# EAGLE design Complete_ePaper_Shoe_Board (EAGLE 8.4.1)

## Sheet 1 of 3
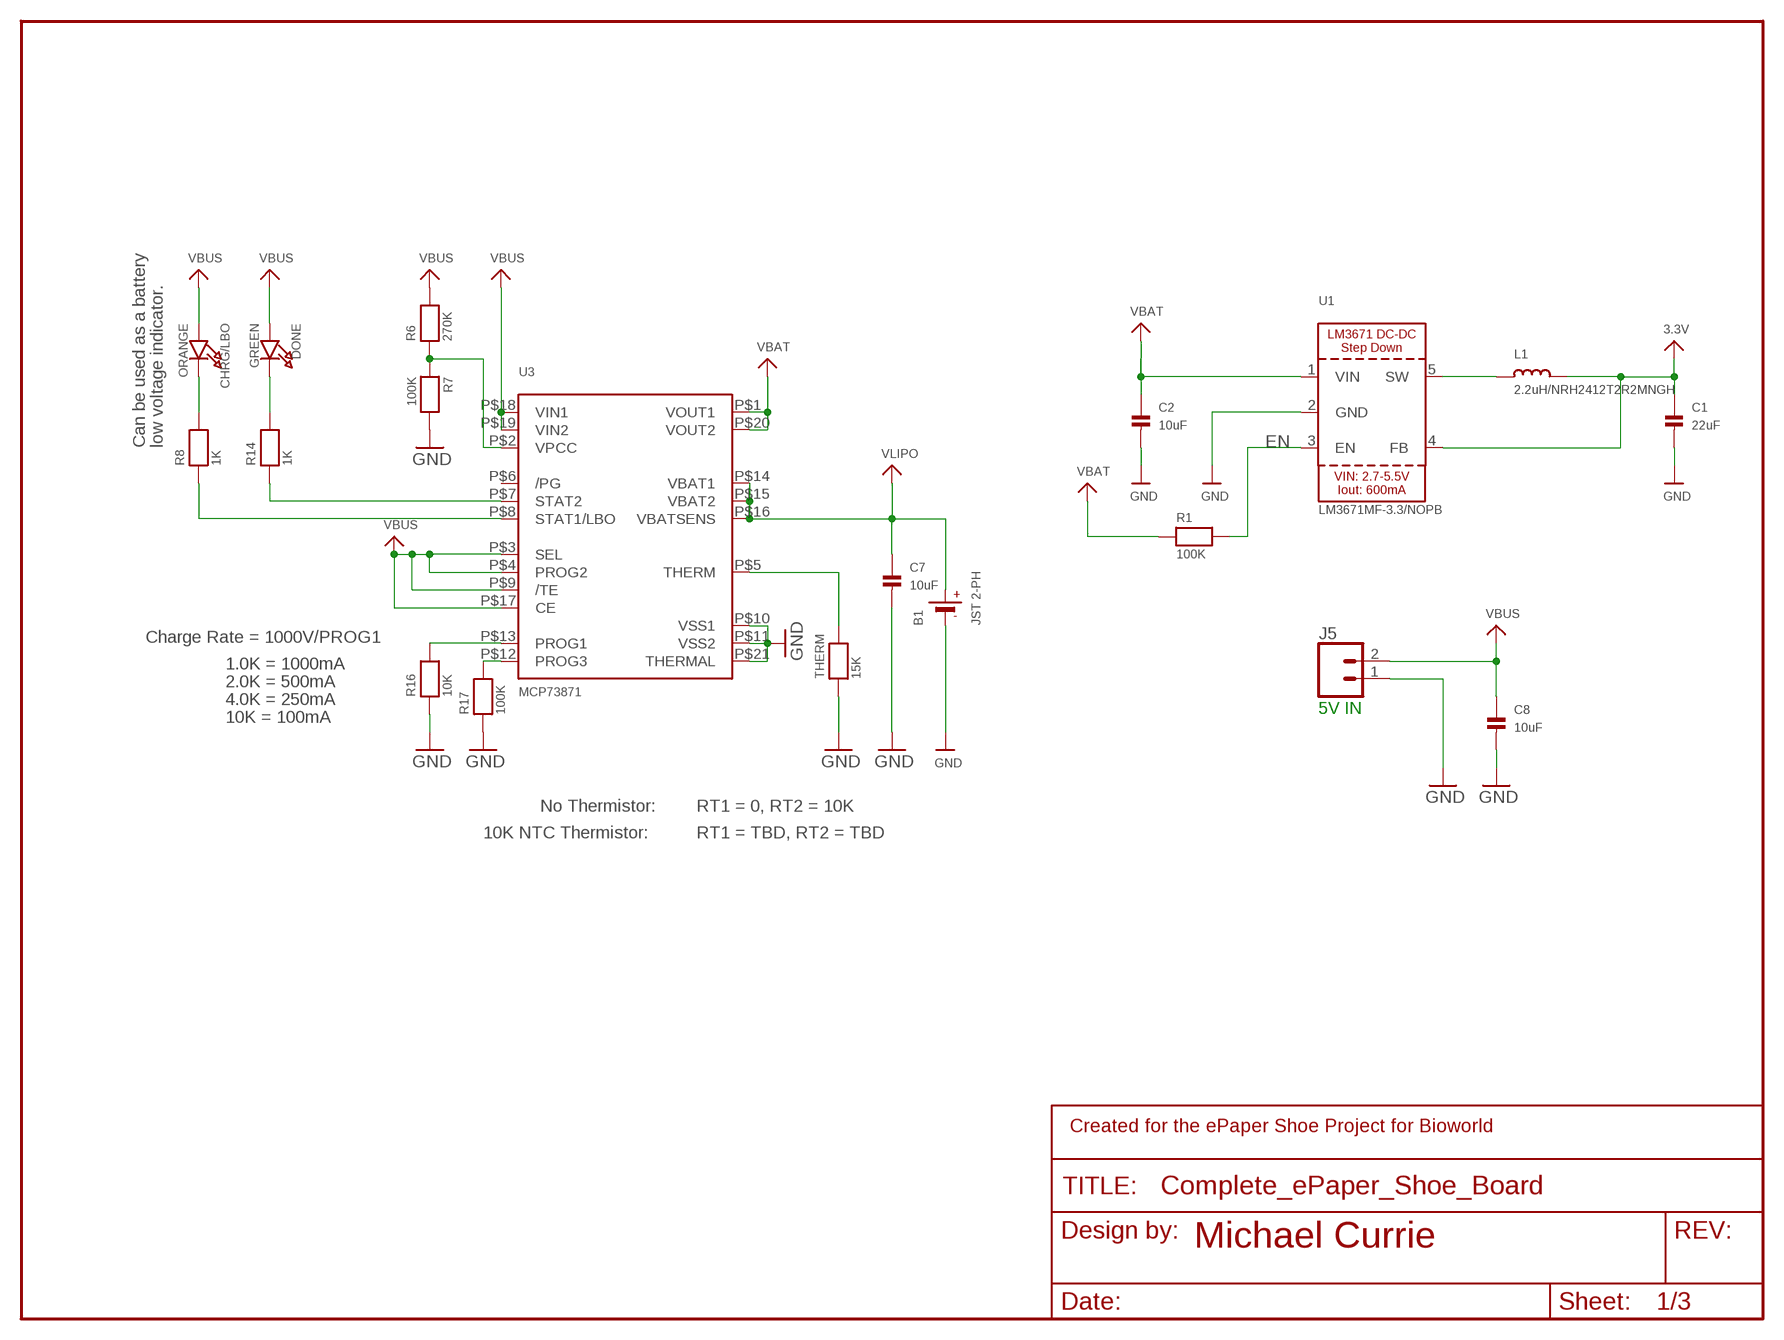
[diagram p0: schematic, sheet 1]

### Parts
B1  JST 2-PH  BATTERY  [JSTPH2]
C1  22uF  CAP_CERAMIC0805  [0805]
C2  10uF  CAP_CERAMIC0805  [0805]
C7  10uF  CAP_CERAMIC0805  [0805]
C8  10uF  CAP_CERAMIC0805  [0805]
CHRG/LBO  ORANGE  LED0805_NOOUTLINE  [CHIPLED_0805_NOOUTLINE]
DONE  GREEN  LED0805_NOOUTLINE  [CHIPLED_0805_NOOUTLINE]
FRAME1  FRAME-LETTER-MICHAELNO_PACKAGE  [DUMMY]
J5  CONN_02  [1X02]
L1  2.2uH/NRH2412T2R2MNGH  INDUCTORNR5040  [INDUCTOR_5X5MM_NR5040_NOTHERMALS]
R1  100K  RESISTOR0805  [0805]
R6  270K  RESISTOR0805  [0805]
R7  100K  RESISTOR0805  [0805]
R8  1K  RESISTOR0805  [0805]
R14  1K  RESISTOR0805  [0805]
R16  10K  RESISTOR0805  [0805]
R17  100K  RESISTOR0805  [0805]
THERM  15K  RESISTOR0805  [0805]
U1  LM3671MF-3.3/NOPB  VREG_LM3671  [SOT23-5]
U3  MCP73871  [QFN20_4MM]

### Nets
3.3V: C1.1 L1.P$2 U1.4(FB) ; also sheet 2,3
EN: R1.2 U1.3(EN)
GND: B1.1(-) C1.2 C2.2 C7.2 C8.2 J5.1 R7.2 R16.1 R17.1 THERM.1 U1.2(GND) U3.P$10(VSS1) U3.P$11(VSS2) U3.P$21(THERMAL) ; also sheet 2,3
N$1: L1.P$1 U1.5(SW)
N$7: R6.1 R7.1 U3.P$2(VPCC)
N$8: DONE.C R14.2
N$9: R14.1 U3.P$7(STAT2)
N$10: THERM.2 U3.P$5(THERM)
N$11: R8.1 U3.P$8(STAT1/LBO)
N$12: CHRG/LBO.C R8.2
N$13: R17.2 U3.P$12(PROG3)
N$16: R16.2 U3.P$13(PROG1)
VBAT: C2.1 R1.1 U1.1(VIN) U3.P$1(VOUT1) U3.P$20(VOUT2)
VBUS: C8.1 CHRG/LBO.A DONE.A J5.2 R6.2 U3.P$3(SEL) U3.P$4(PROG2) U3.P$9(/TE) U3.P$17(CE) U3.P$18(VIN1) U3.P$19(VIN2)
VLIPO: B1.2(+) C7.1 U3.P$14(VBAT1) U3.P$15(VBAT2) U3.P$16(VBATSENS)
Unconnected: U3.P$6(/PG)

### Notes on the sheet
- Can be used as a battery | low voltage indicator.
- Charge Rate = 1000V/PROG1
- 1.0K = 1000mA
- 2.0K = 500mA
- 4.0K = 250mA
- 5V IN
- 10K = 100mA
- No Thermistor: | RT1 = 0, RT2 = 10K
- 10K NTC Thermistor: | RT1 = TBD, RT2 = TBD

## Sheet 2 of 3
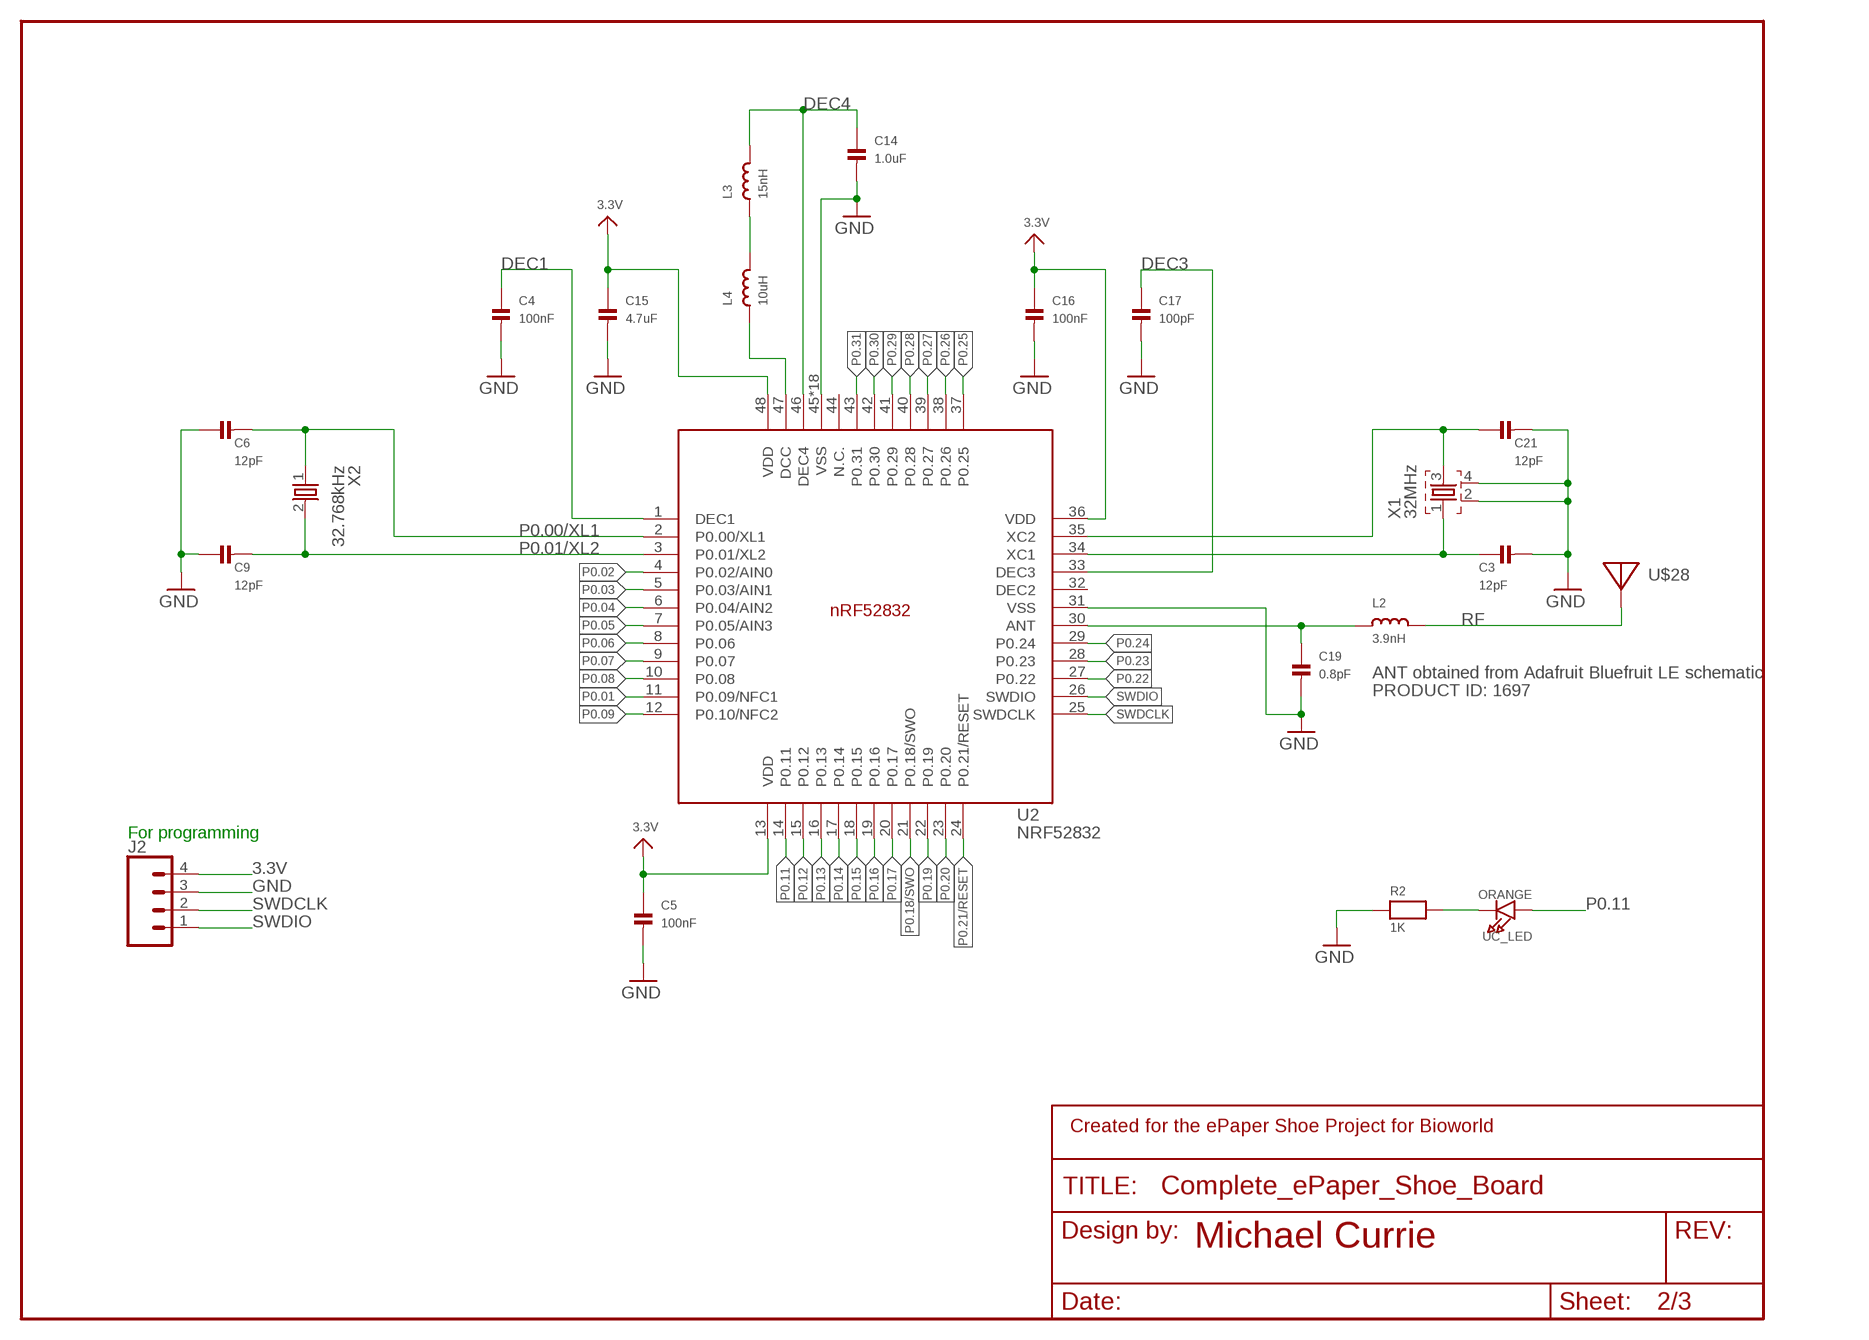
[diagram p1: schematic, sheet 2]

### Parts
C3  12pF  CAP_CERAMIC0805  [0805]
C4  100nF  CAP_CERAMIC0805  [0805]
C5  100nF  CAP_CERAMIC0805  [0805]
C6  12pF  CAP_CERAMIC0805  [0805]
C9  12pF  CAP_CERAMIC0805  [0805]
C14  1.0uF  CAP_CERAMIC0805  [0805]
C15  4.7uF  CAP_CERAMIC0805  [0805]
C16  100nF  CAP_CERAMIC0805  [0805]
C17  100pF  CAP_CERAMIC0805  [0805]
C19  0.8pF  CAP_CERAMIC0805  [0805]
C21  12pF  CAP_CERAMIC0805  [0805]
FRAME2  FRAME-LETTER-MICHAELNO_PACKAGE  [DUMMY]
J2  CONN_04  [1X04]
L2  3.9nH  INDUCTOR0805  [0805]
L3  15nH  INDUCTOR0805  [0805]
L4  10uH  INDUCTOR0805  [0805]
R2  1K  RESISTOR0805  [0805]
U2  NRF52832  [QFN40P600X600X90-48_N]
U$28  ANTENNA_PCBNRF8001_1.6MM  [ANT_PCB_2.4GHZ_NRF8001_1.6MM_1OZ]
UC_LED  ORANGE  LED0805_NOOUTLINE  [CHIPLED_0805_NOOUTLINE]
X1  32MHz  XTAL_32MHZ  [BT-XTAL_2016_N]
X2  32.768kHz  XTAL_32KHZ  [XTAL_3215_N]

### Nets
3.3V: C5.1 C15.1 C16.1 J2.4 U2.13(VDD) U2.36(VDD) U2.48(VDD) ; also sheet 1,3
ANT: C19.1 L2.1 U2.30(ANT)
DEC1: C4.1 U2.1(DEC1)
DEC3: C17.1 U2.33(DEC3)
DEC4: C14.1 L3.2 U2.46(DEC4)
GND: C3.2 C4.2 C5.2 C6.1 C9.1 C14.2 C15.2 C16.2 C17.2 C19.2 C21.2 J2.3 R2.1 U2.31(VSS) U2.45(VSS) U2.PAD(VSS) U2.PAD@VIA01(VSS) U2.PAD@VIA02(VSS) U2.PAD@VIA03(VSS) U2.PAD@VIA04(VSS) U2.PAD@VIA05(VSS) U2.PAD@VIA06(VSS) U2.PAD@VIA07(VSS) U2.PAD@VIA08(VSS) U2.PAD@VIA09(VSS) U2.PAD@VIA10(VSS) U2.PAD@VIA11(VSS) U2.PAD@VIA12(VSS) U2.PAD@VIA13(VSS) U2.PAD@VIA14(VSS) U2.PAD@VIA15(VSS) U2.PAD@VIA16(VSS) X1.2 X1.4 ; also sheet 1,3
N$2: L3.1 L4.2
N$3: C21.1 U2.35(XC2) X1.3
N$5: L4.1 U2.47(DCC)
N$15: R2.2 UC_LED.C
P0.00/XL1: C6.2 U2.2(P0.00/XL1) X2.1
P0.01: U2.11(P0.09/NFC1)
P0.01/XL2: C9.2 U2.3(P0.01/XL2) X2.2
P0.02: U2.4(P0.02/AIN0)
P0.03: U2.5(P0.03/AIN1)
P0.04: U2.6(P0.04/AIN2)
P0.05: U2.7(P0.05/AIN3)
P0.06: U2.8(P0.06)
P0.07: U2.9(P0.07)
P0.08: U2.10(P0.08)
P0.09: U2.12(P0.10/NFC2)
P0.11: U2.14(P0.11) UC_LED.A
P0.12: U2.15(P0.12)
P0.13: U2.16(P0.13)
P0.14: U2.17(P0.14)
P0.15: U2.18(P0.15)
P0.16: U2.19(P0.16)
P0.17: U2.20(P0.17)
P0.18/SWO: U2.21(P0.18/SWO)
P0.19: U2.22(P0.19)
P0.20: U2.23(P0.20)
P0.21/RESET: U2.24(P0.21/RESET)
P0.22: U2.27(P0.22) ; also sheet 3
P0.23: U2.28(P0.23) ; also sheet 3
P0.24: U2.29(P0.24) ; also sheet 3
P0.25: U2.37(P0.25) ; also sheet 3
P0.26: U2.38(P0.26)
P0.27: U2.39(P0.27)
P0.28: U2.40(P0.28)
P0.29: U2.41(P0.29)
P0.30: U2.42(P0.30) ; also sheet 3
P0.31: U2.43(P0.31) ; also sheet 3
RF: L2.2 U$28.FEED
SWDCLK: J2.2 U2.25(SWDCLK)
SWDIO: J2.1 U2.26(SWDIO)
X1: C3.1 U2.34(XC1) X1.1
Unconnected: U2.32(DEC2) U2.44(N.C.)

### Notes on the sheet
- ANT obtained from Adafruit Bluefruit LE schematic
- PRODUCT ID: 1697
- For programming

## Sheet 3 of 3
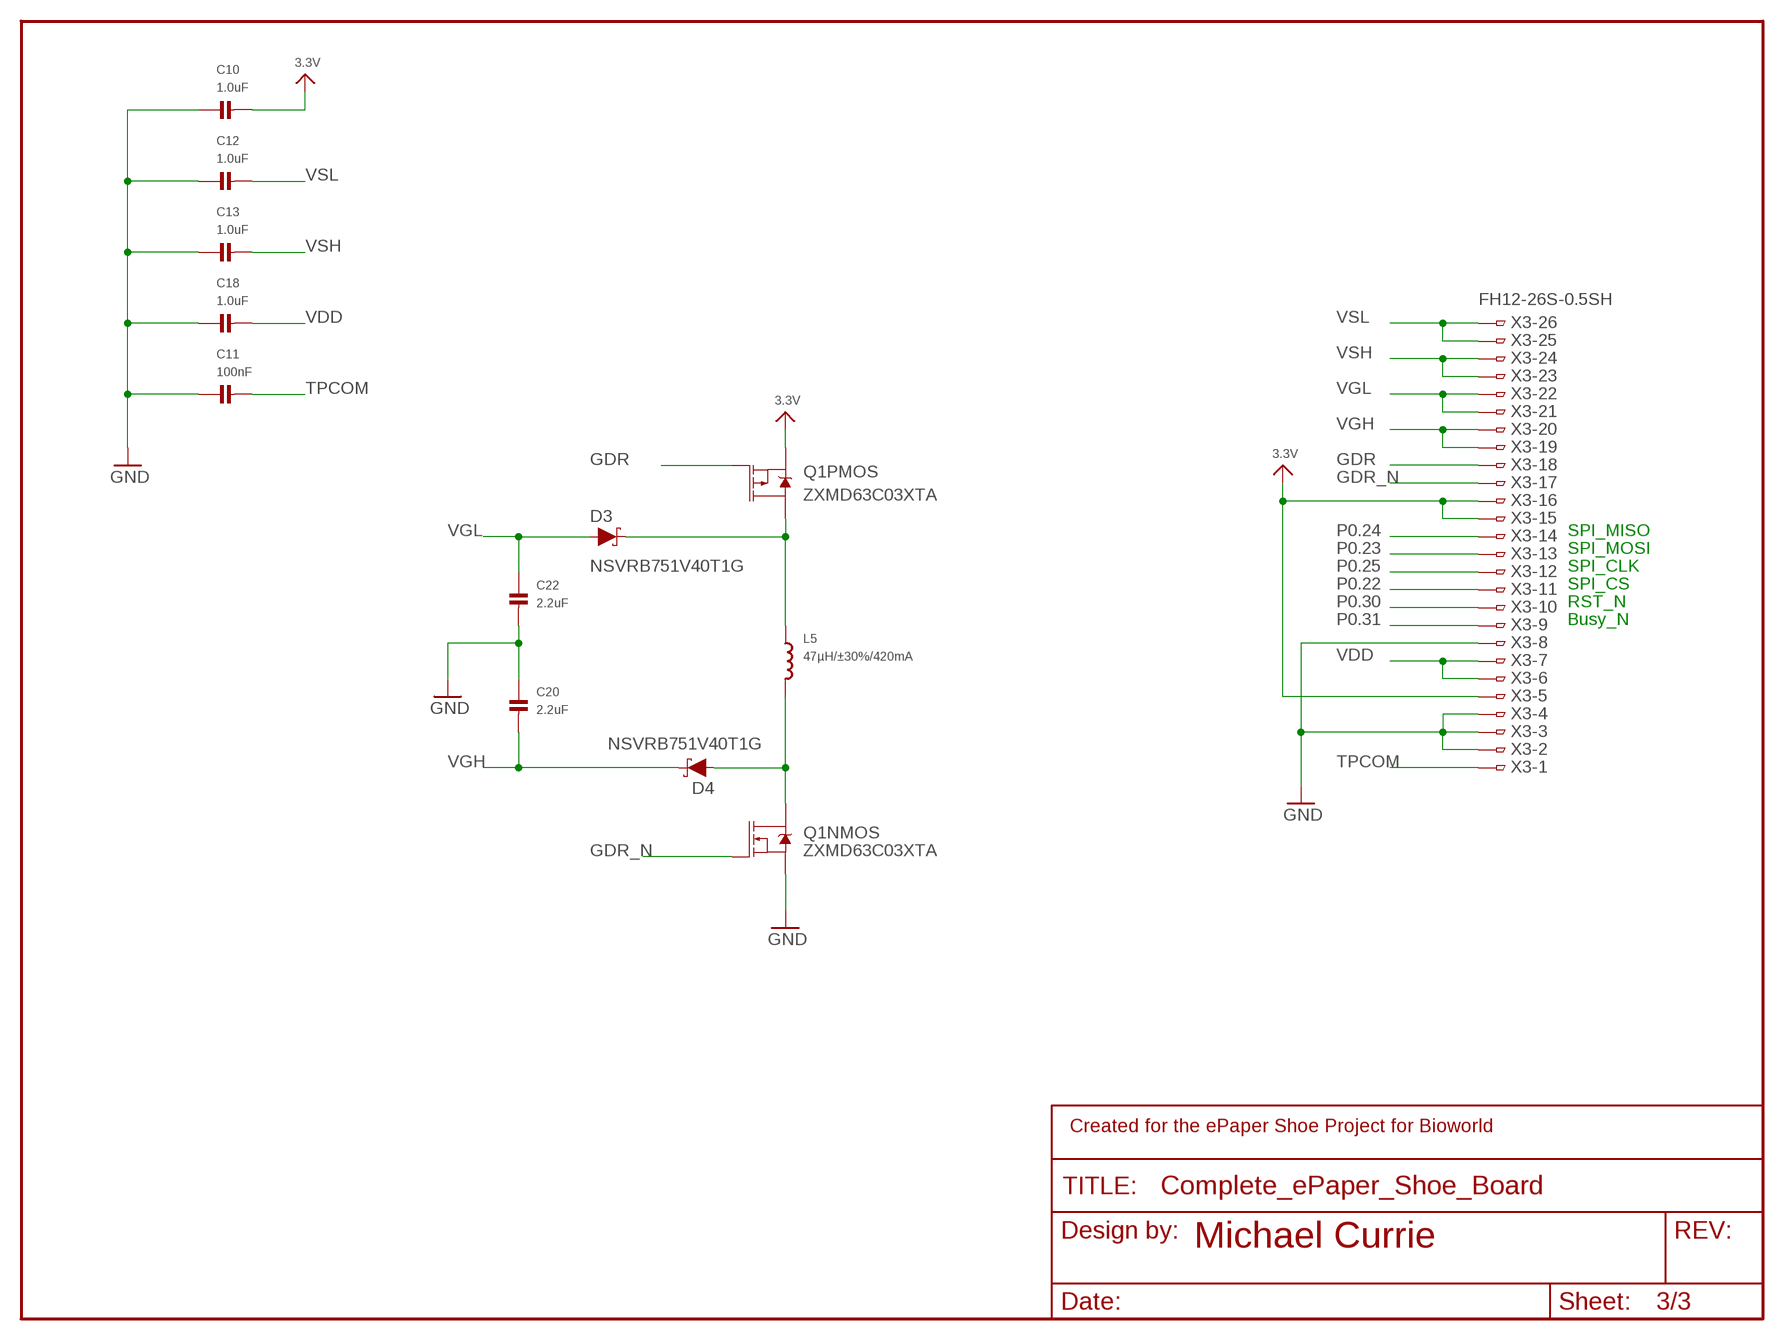
[diagram p2: schematic, sheet 3]

### Parts
C10  1.0uF  CAP_CERAMIC0805  [0805]
C11  100nF  CAP_CERAMIC0805  [0805]
C12  1.0uF  CAP_CERAMIC0805  [0805]
C13  1.0uF  CAP_CERAMIC0805  [0805]
C18  1.0uF  CAP_CERAMIC0805  [0805]
C20  2.2uF  CAP_CERAMIC0805  [0805]
C22  2.2uF  CAP_CERAMIC0805  [0805]
D3  0.5A/40V/420mV  DIODE-SCHOTTKY-PMEG4005EJ  [SOD-323]
D4  0.5A/40V/420mV  DIODE-SCHOTTKY-PMEG4005EJ  [SOD-323]
FRAME3  FRAME-LETTER-MICHAELNO_PACKAGE  [DUMMY]
L5  47µH/±30%/420mA  INDUCTORNR5040  [INDUCTOR_5X5MM_NR5040_NOTHERMALS]
Q1  IRF7509  [MSOP8]
X3  FH12-26S-0.5SH  [FH12-26S-0.5SH]

### Nets
3.3V: C10.2 Q1.3(PMOS:S) X3.5 X3.15 X3.16 ; also sheet 1,2
GDR: Q1.4(PMOS:G) X3.18
GDR_N: Q1.2(NMOS:G) X3.17
GND: C10.1 C11.1 C12.1 C13.1 C18.1 C20.1 C22.2 Q1.1(NMOS:S) X3.2 X3.3 X3.4 X3.8 ; also sheet 1,2
N$4: D3.C L5.P$1 Q1.5(PMOS:D) Q1.6(PMOS:D)
N$6: D4.A L5.P$2 Q1.7(NMOS:D) Q1.8(NMOS:D)
P0.22: X3.11 ; also sheet 2
P0.23: X3.13 ; also sheet 2
P0.24: X3.14 ; also sheet 2
P0.25: X3.12 ; also sheet 2
P0.30: X3.10 ; also sheet 2
P0.31: X3.9 ; also sheet 2
TPCOM: C11.2 X3.1
VDD: C18.2 X3.6 X3.7
VGH: C20.2 D4.C X3.19 X3.20
VGL: C22.1 D3.A X3.21 X3.22
VSH: C13.2 X3.23 X3.24
VSL: C12.2 X3.25 X3.26

### Notes on the sheet
- ZXMD63C03XTA
- SPI_MISO
- SPI_MOSI
- NSVRB751V40T1G | SPI_CLK
- SPI_CS
- RST_N
- Busy_N
- NSVRB751V40T1G
- ZXMD63C03XTA

## Library data of the parts
B1 = microbuilder:BATTERY: CR1220 SMT - Digikey: 3001K-ND
C1-C22 = microbuilder:CAP_CERAMIC: Ceramic Capacitors 0402 - 0402 Surface Mount Capacitors 16pF 50V 5% [Digikey: 445-4899-2-ND] 18pF 50V 5% [Digikey: 490-1281-2-ND] 22pF 50V 5% [Digikey: 490-1283-2-ND] 68pF 50V 5% [Digikey: 490-1289-2-ND] 0.1uF 10V 10% [Digikey: 490-1318-2-ND] 1.0uF 6.3V 10% [Digikey: 490-1320-2-ND] 0603 - 0603 Surface Mount Capacitors 16 pF 50V 5% [Digikey: 445-5051-2-ND] 22 pF 50V [Digikey: PCC220ACVTR-ND] 33 pF 50V 5% [Digikey: 490-1415-1-ND] 56pF 50V 5% [Digikey: 490-1421-1-ND] 220pF 50V 5% [Digikey: 445-1285-1-ND] 680 pF 50V 2200 pF 50V 5% C0G [Digikey: 445-1297-1-ND] 5600 pF 100V 5% X7R [Digikey: 478-3711-1-ND] 0.1 µF 25V 10% [Digikey: PCC2277TR-ND] 0.22 µF 16V 10% X7R [Digikey: 445-1318-1-ND] 1.0 µF 25V 10% [Digikey: 445-5146-2-ND] 0603 - RF Specific 3pF 250V +/-0.1pF RF [Digikey: 712-1347-1-ND] 18 pF 250V 5% [Digikey: 478-3505-1-ND or 712-1322-1-ND] 56 pF 250V 5% C0G RF [Digikey: 490-4867-1-ND] 68 pF 250V RF [Digikey: 490-4868-1-ND] 0805 - 0805 Surface Mount Capacitors 220 pF 250V 2% RF Ceramic Capacitor [Digikey: 712-1398-1-ND] 1000 pF 50V 2% NP0 Ceramic Capacitor [Digikey: 478-3760-1-ND] 0.1 µF 25V 10% Ceramic Capacitor [Digikey: PCC1828TR-ND] 1.0 µF 16V 10% Ceramic Capacitor[Digikey: 490-1691-2-ND] 10.0 µF 10V 10% Ceramic Capacitor[Digikey: 709-1228-1-ND] 10.0 uF 16V 10% Ceramic Capacitor [Digikey: 478-5165-2-ND] 47 uF 6.3V 20% Ceramic Capacitor [Digikey: 587-1779-1-ND or 399-5506-1-ND] 1206 - 1206 Surface Mount Capacitors 47uF 10V 20% Ceramic Capacitor [Digikey: 490-5528-1-ND or 399-5508-1-ND or 445-6010-1-ND] 100uF 6.3V -20%, +80% Y5V Ceramic Capacitor (Digikey: 490-4512-1-ND, Mouser: 81-GRM31CF50J107ZE1L)
CHRG/LBO DONE UC_LED = microbuilder:LED: LED 0603 - 0603 Surface Mount Package 2mA: Green LED - Low Power (3.9mcd, 2ma, 1.7Vf) - Digikey: 475-2709-2-ND Orange LED - Low Power (9.8mcd, 2ma, 1.8Vf) - Digikey: 475-1194-2-ND Red LED - Low Power (5mcd, 2ma, 1.8Vf) - Digikey: 475-1195-2-ND Yellow LED - Low Power (7mcd, 2ma, 1.8Vf) - Digikey: 475-1196-2-ND 5mA: Blue LED - Low Power (17mcd, 5ma, 2.9Vf) - Digikey: LNJ937W8CRACT-ND 0805 - 0805 Surface Mount Package 2mA: Red LED (8.8mcd, 2mA, 1.8Vf, Clear) - Low Power [Digikey: 475-2510-1-ND] Green LED (5mcd, 2mA, 1.8Vf, Clear) - Low Power [Digikey: 475-2730-1-ND] Yellow LED (11.3mcd, 2mA, 1.8Vf, Clear) - Low Power [Digikey: 475-2555-1-ND] 20mA: Red LED (104mcd, 20mA, Diffused) - LS R976 [Digikey: 475-1278-6-ND] Red LED (12mcd, 20mA, 2.0Vf, Clear) - APT2012EC [Digikey: 754-1128-1-ND] Green LED (15mcd, 20mA, 2.2Vf, Clear) - APT2012GC [Digikey: 754-1131-1-ND] Orange LED (160mcd, 20mA, 2.1Vf, Clear) - APT2012SECK [Digikey: 754-1130-1-ND] 1206 - 1206 Surface Mount Package Green LED (26mcd, 20mA, Diffused) - LG N971 [Digikey: 475-1407-6-ND] Red LED (15mcd, 20mA, Diffused) - LH N974 [Digikey: 475-1416-6-ND]
D3 D4 = SparkFun-DiscreteSemi:DIODE-SCHOTTKY: Schottky diode A Schottky diode is a semiconductor diode which has a low forward voltage drop and a very fast switching action.; PROD_ID: DIO-10955
FRAME1-FRAME3 = SparkFun-Aesthetics:FRAME-LETTER-MICHAEL: Schematic Frame - Letter Standard 8.5x11 US Letter frame; DESIGNER: Nobody; VERSION: v01
J2 = SparkFun-Connectors:CONN_04: Multi connection point. Often used as Generic Header-pin footprint for 0.1 inch spaced/style header connections On any of the 0.1 inch spaced packages, you can populate with these: Break Away Headers - Straight <https://www.sparkfun.com/products/116> (PRT-00116) Break Away Male Headers - Right Angle <https://www.sparkfun.com/products/553> (PRT-00553) Female Headers <https://www.sparkfun.com/products/115> (PRT-00115) Break Away Headers - Machine Pin <https://www.sparkfun.com/products/117> (PRT-00117) Break Away Female Headers - Swiss Machine Pin <https://www.sparkfun.com/products/743> (PRT-00743) For SCREWTERMINALS and SPRING TERMINALS visit here: Screw Terimnals on SparkFun.com <https://www.sparkfun.com/search/results?term=Screw+Terminals> (5mm/3.5mm/2.54mm spacing) This device is also useful as a general connection point to wire up your design to another part of your project. Our various solder wires solder well into these plated through hole pads. Hook-Up Wire - Assortment (Stranded, 22 AWG) <https://www.sparkfun.com/products/11375> (PRT-11375) Hook-Up Wire - Assortment (Solid Core, 22 AWG) <https://www.sparkfun.com/products/11367> (PRT-11367) View the entire wire category on our website here <https://www.sparkfun.com/categories/141> Special notes: Molex polarized connector foot print use with SKU : PRT-08231 with associated crimp pins and housings. 1MM SMD Version SKU: PRT-10208; PROD_ID: CONN-09696
J5 = SparkFun-Connectors:CONN_02: Multi connection point. Often used as Generic Header-pin footprint for 0.1 inch spaced/style header connections On any of the 0.1 inch spaced packages, you can populate with these: Break Away Headers - Straight <https://www.sparkfun.com/products/116> (PRT-00116) Break Away Male Headers - Right Angle <https://www.sparkfun.com/products/553> (PRT-00553) Female Headers <https://www.sparkfun.com/products/115> (PRT-00115) Break Away Headers - Machine Pin <https://www.sparkfun.com/products/117> (PRT-00117) Break Away Female Headers - Swiss Machine Pin <https://www.sparkfun.com/products/743> (PRT-00743) For SCREWTERMINALS and SPRING TERMINALS visit here: Screw Terimnals on SparkFun.com <https://www.sparkfun.com/search/results?term=Screw+Terminals> (5mm/3.5mm/2.54mm spacing) This device is also useful as a general connection point to wire up your design to another part of your project. Our various solder wires solder well into these plated through hole pads. Hook-Up Wire - Assortment (Stranded, 22 AWG) <https://www.sparkfun.com/products/11375> (PRT-11375) Hook-Up Wire - Assortment (Solid Core, 22 AWG) <https://www.sparkfun.com/products/11367> (PRT-11367) View the entire wire category on our website here <https://www.sparkfun.com/categories/141> Special notes: Molex polarized connector foot print use with: PRT-08233 with associated crimp pins and housings. 2.54_SCREWTERM for use with PRT-10571. 3.5mm Screw Terminal footprints for PRT-08084 5mm Screw Terminal footprints for use with PRT-08432
L1-L5 = microbuilder:INDUCTOR: Inductors 0603: 10nH Ceramic Inductor - microwire antenna/RF (Digikey: 712-1434-2-ND) 0805: 560nH Ceramic Inductor - RF (Digikey: 553-1047-1-ND) 270nH Ceramic Inductor - Q = 40@250MHz, +-5%, 1 Ohm DC Resistance (Digikey: 535-10506-2-ND) 1007 (2518 Metric) SMT: 10µH 10% 250mOhm 820mA 1007 Inductor (Digikey: 587-2189-1-ND) 22µH 10% 500mOhm 580mA 1007 Inductor (Digikey: 587-2190-1-ND) 47µH 10% 950mOhm 420mA 1007 Inductor (Digikey: 587-2191-1-ND) 47µH 5% 100mOhm 1A 1008 Inductor (Digikey: 732-1816-1-ND) 5.0x5.0mm (Taiyo Yuden NR5040 Series) 6.8µH 20% 2.3A 64mOhm Inductor (Digikey: 587-2374-2-ND) 5.0x5.0mm (TDK VLC5045 Series) 4.7µH 20% 3.3A 34mOhm Inductor (Digikey: 445-6526-1-ND) 6.8µH 20% 2.7A 46mOhm Inductor (Digikey: 445-6527-1-ND) 6.0x6.0mm (TDK VLC6045 Series) 4.7µH 20% 3.8A 27mOhm Inductor (Digikey: 445-6538-2-ND) 6.8µH 20% 3A 41mOhm Inductor (Digikey: 445-6540-1-ND) 6.2µH 30% 2.2A 45mOhm Inductor (Digikey: SRR5028-6R2YCT-ND) - Not TDK VLC6045 but footprint should match 6.0x6.0mm (TDK SLF6045 Series) 6.8uH 30% 2A 33mOhm Inductor (Digikey: 445-4572-1-ND, Mouser: 810-SLF645T6R8N2R0PF)
Q1 = SparkFun-DiscreteSemi:IRF7509: Dual N and P Channel MOSFET Dual N/P-Channel 30V 1.25 W 7.8/7.5 nC Hexfet Power Mosfet Surface Mount-MICRO-8. NMOS RDS(ON) 0.11Ω. PMOS RDS(ON) 0.20Ω. Link to datasheet <http://www.irf.com/product-info/datasheets/data/irf7509pbf.pdf> SparkFun Products: SparkFun RedBot Mainboard <https://www.sparkfun.com/products/12097> SparkFun Wake on Shake <https://www.sparkfun.com/products/11447>; PROD_ID: TRANS-07913
R1 R2 R6-R8 R14 R16 R17 THERM = microbuilder:RESISTOR: Resistors 0402 - 0402 Surface Mount Package 22 Ohm 1% 1/16W [Digikey: 311-22.0LRTR-ND] 33 Ohm 5% 1/16W 1.0K 5% 1/16W 1.5K 5% 1/16W 2.0K 1% 1/16W 10.0K 1% 1/16W [Digikey: 311-10.0KLRTR-ND] 10.0K 5% 1/16W [Digikey: RMCF0402JT10K0TR-ND] 12.1K 1% 1/16W [Digikey: 311-22.0LRTR-ND] 100.0K 5% 1/16W 0603 - 0603 Surface Mount Package 0 Ohm 1/10 Watt 1% Resistor 15 Ohm 1/10 Watt 1% Resistor 33 Ohm 1/10 Watt 1% Resistor 49.9 Ohm 1/10 Watt 1% Resistor 100 Ohm 1/10 Watt 1% Resistor 150 Ohm 1/10 Watt 1% Resistor 240 Ohm 1/10 Watt 1% Resistor 390 Ohm 1/10 Watt 1% Resistor 560 Ohm 1/10 Watt 1% Resistor 680 Ohm 1/10 Watt 1% Resistor 750 Ohm 1/10 Watt 1% Resistor 1.0K Ohm 1/10 Watt 1% Resistor 1.5K Ohm 1/10 Watt 1% Resistor 2.0K Ohm 1/10 Watt 1% Resistor 2.2K Ohm 1/10 Watt 1% Resistor 3.3K Ohm 1/10 Watt 1% Resistor 4.7K Ohm 1/10 Watt 1% Resistor 10.0K Ohm 1/10 Watt 1% Resistor 12.0K Ohm 1/10 Watt 1% Resistor 12.1K Ohm 1/10 Watt 1% Resistor 20.0K Ohm 1/10 Watt 1% Resistor 33.0K Ohm 1/10 Watt 1% Resistor 100.0K Ohm 1/10 Watt 1% Resistor 0805 - 0805 Surface Mount Package 0 Ohm 1/8 Watt 1% Resistor 33 Ohm 1/8 Watt 1% Resistor 100 Ohm 1/8 Watt 1% Resistor 150 Ohm 1/8 Watt 1% Resistor 200 Ohm 1/8 Watt 1% Resistor 240 Ohm 1/8 Watt 1% Resistor 330 Ohm 1/8 Watt 1% Resistor 390 Ohm 1/8 Watt 1% Resistor 470 Ohm 1/8 Watt 1% Resistor 1.0K Ohm 1/8 Watt 1% Resistor 1.5K Ohm 1/8 Watt 1% Resistor 2.0K Ohm 1/8 Watt 1% Resistor 4.7K Ohm 1/8 Watt 1% Resistor 5.1K Ohm 1/8 Watt 1% Resistor 5.6K Ohm 1/8 Watt 1% Resistor 10.0K Ohm 1/8 Watt 1% Resistor 22.0K Ohm 1/8 Watt 1% Resistor 33.0K Ohm 1/8 Watt 1% Resistor 100K Ohm 1/8 Watt 1% Resistor 1206 - 1206 Surface Mount Package 2012 - 2010 Surface Mount Package 0.11 Ohm 1/2 Watt 1% Resistor - Digikey: RHM.11UCT-ND
U1 = microbuilder:VREG_LM3671: LM3671 - 600mA DC-DC Step-Down Converter VIN: 2.7-5.5V Load Current: 600mA Switching Frequency: 2MHz Iq: 16uA
U2 = Nordic_nRF:NRF52832: nRF52832 Features Single chip, highly flexible, 2.4 GHz multi-protocol SoC 32-bit ARM Cortex-M4F Processor 1.7v to 3.6v operation 512kB flash + 64kB RAM Supports concurrent Bluetooth Smart/ANT protocol operation On-chip NFC tag for Out-of-Band (OOB) pairing Up to +4dBm output power -96dBm sensitivity, Bluetooth Smart Thread safe and run-time protected Event driven API On air compatible with nRF24L and nRF24AP series 2 data rates (2Mbps/1Mbps) PPI - maximum flexibility for power-efficient applications and code simplification Automated power management system with automatic power management of each peripheral Configurable I/O mapping for analog and digital I/O 3 x Master/Slave SPI 2 x Two-wire interface (I²C) UART (RTS/CTS) 3 x PWM AES HW encryption Real Time Counter (RTC) Digital microphone interface (PDM) On-chip balun Applications Internet of Things (IoT) Wearables SmartHome sensors Connected white goods Computer peripherals Voice-command smart remotes A4WP ‘Rezence’ wireless charging Beacons Sports and fitness sensors and hubs Connected health products Smart watches RC Toys Interactive games Building automation and sensor networks
U3 = microbuilder:MCP73871: MCP73871 Lithium Polymer Battery Charger Digikey: MCP73871-2CCI/ML-ND
U$28 = microbuilder:ANTENNA_PCB: Various pre-calculated PCB Antennas NRF8001 1.6mm 1Oz - 2.4GHz PCB antenna for 1.6mm PCBs with 1oz copper, double-sided boards (no GND plan beneath antenna). See nRF2740 production files for further information and impedance matching network. 868MHz/2.4GHz DUALBAND - Dual 868MHz and 2.4GHz centered antenna based on board #6 of the CC-ANTENNA-DK from Chipcon/TI
X1 = Nordic_nRF:XTAL_32MHZ
X2 = Nordic_nRF:XTAL_32KHZ
X3 = con-hirose:FH12-26S-0.5S: 0.5mm Pitch Connectors For FPC/FFC Source: Data sheet <http://www.hirose.co.jp/cataloge_hp/e58605370.pdf>; MPN: FH12-26S-0.5SH(55); OC_FARNELL: 1324553; OC_NEWARK: 34M6172

## Board
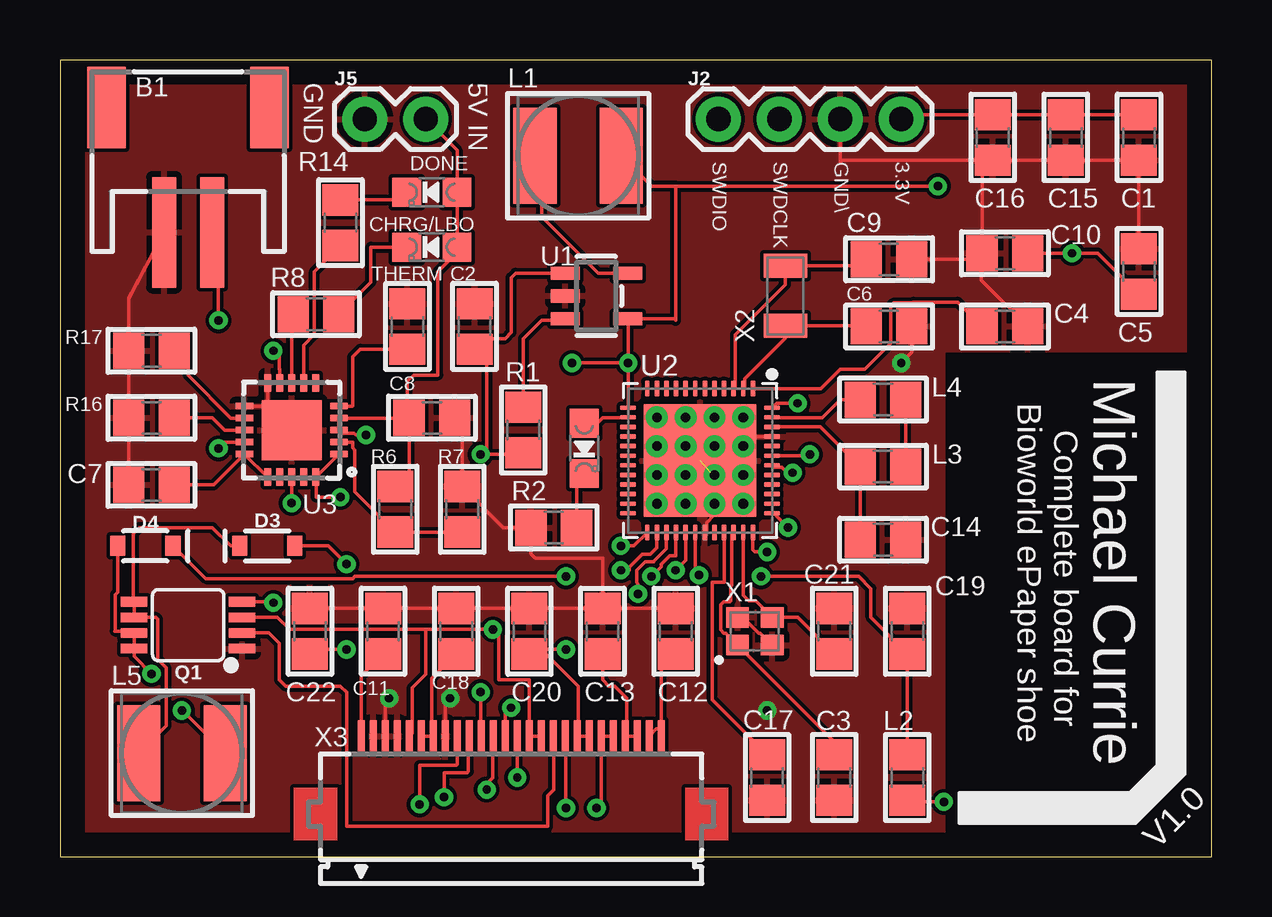
[diagram p3: board, top side]
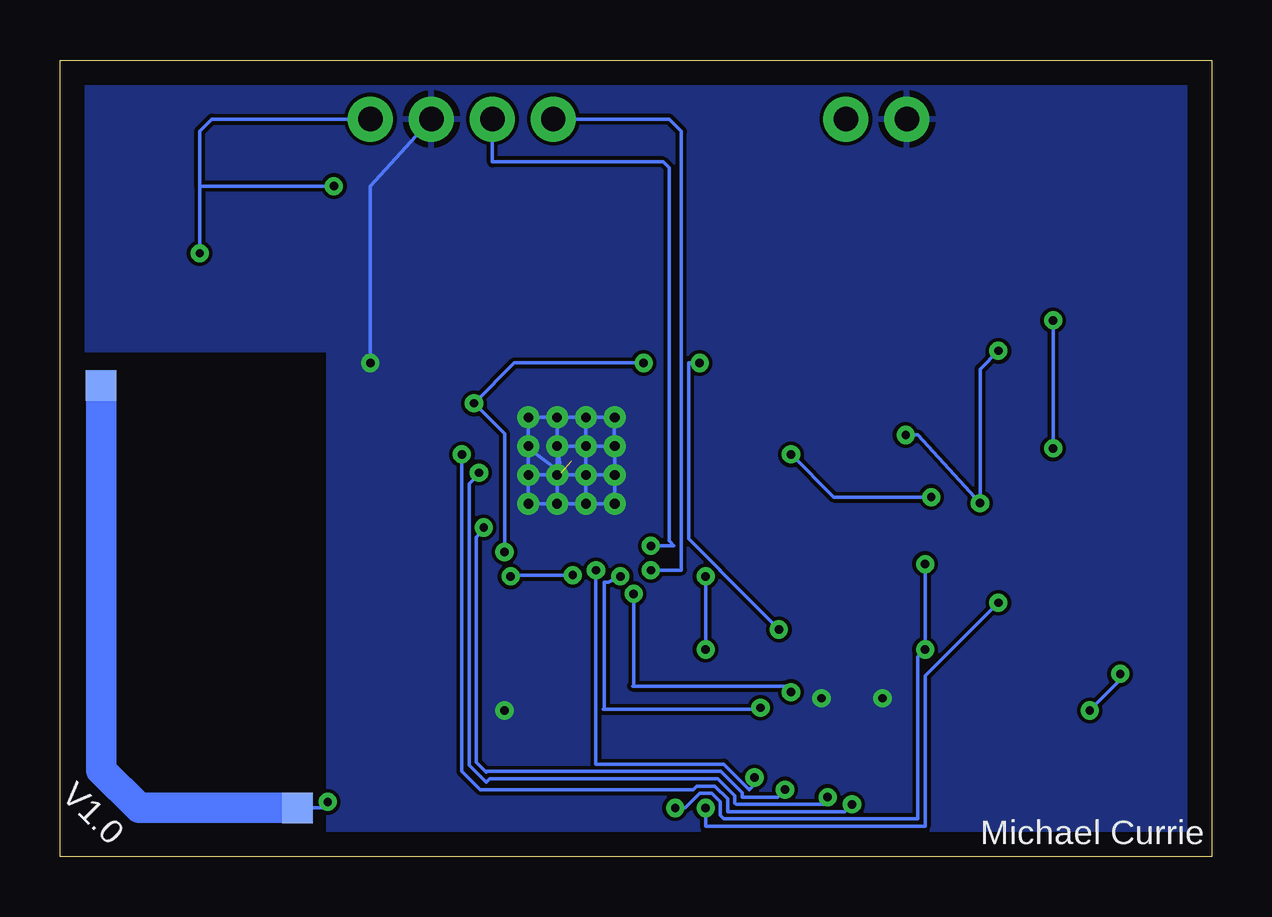
[diagram p4: board, bottom side, seen from below]

Size 47.99 x 33.2 mm. Coordinates in mm from the lower left corner, seen from the top.
Outline: 0,0 47.99,0 47.99,33.2 0,33.2 0,0
Copper layers (1*16): Top 0.035mm / dielectric 1.5mm / Bottom 0.035mm
Design rules "default": minimum track width 6mil, minimum drill 0.35mm, track to track 6mil, track to pad 6mil, pad to pad 6mil, via to via 6mil, smd to smd 6mil, copper to edge 40mil, drill to drill 6mil, minimum pad ring 10mil, minimum via ring 8mil, stop-mask expansion 4mil, vias tented up to drill 0mil, thermal gap 10mil

### Footprints (pad centres in the part's own frame; a part is rotated, then mirrored left to right if it is on the bottom)
JSTPH2 = smd 1 x 4.6: 1 -1,-3.7; 2 1,-3.7 | smd 1.6 x 3.4: NC1 -3.4,1.5; NC2 3.4,1.5
0805 = smd 1.3 x 1.5: 1 -0.95,0; 2 0.95,0
CHIPLED_0805_NOOUTLINE = smd 1.2 x 1.2: A 0,-1.05; C 0,1.05
SOD-323 = smd 0.63 x 0.83: A 1.15,0; C -1.15,0
1X04 = drill 1.016 pad 1.88: 1 0,0; 2 2.54,0; 3 5.08,0; 4 7.62,0
1X02 = drill 1.016 pad 1.88: 1 0,0; 2 2.54,0
INDUCTOR_5X5MM_NR5040_NOTHERMALS = smd 1.8 x 4: P$1 -1.8,0; P$2 1.8,0
MSOP8 = smd 0.4 x 1.1: 1 -0.975,-2.25; 2 -0.325,-2.25; 3 0.325,-2.25; 4 0.975,-2.25; 5 0.975,2.25; 6 0.325,2.25; 7 -0.325,2.25; 8 -0.975,2.25
SOT23-5 = smd 0.55 x 1.2: 1 -0.95,-1.3; 2 0,-1.3; 3 0.95,-1.3; 4 0.95,1.3; 5 -0.95,1.3
QFN40P600X600X90-48_N = smd 0.65 x 0.2: 1 -3,2.2; 2 -3,1.8; 3 -3,1.4; 4 -3,1; 5 -3,0.6; 6 -3,0.2; 7 -3,-0.2; 8 -3,-0.6; 9 -3,-1; 10 -3,-1.4; 11 -3,-1.8; 12 -3,-2.2; 25 3,-2.2; 26 3,-1.8; 27 3,-1.4; 28 3,-1; 29 3,-0.6; 30 3,-0.2; 31 3,0.2; 32 3,0.6; 33 3,1; 34 3,1.4; 35 3,1.8; 36 3,2.2 | smd 0.2 x 0.65: 13 -2.2,-3; 14 -1.8,-3; 15 -1.4,-3; 16 -1,-3; 17 -0.6,-3; 18 -0.2,-3; 19 0.2,-3; 20 0.6,-3; 21 1,-3; 22 1.4,-3; 23 1.8,-3; 24 2.2,-3; 37 2.2,3; 38 1.8,3; 39 1.4,3; 40 1,3; 41 0.6,3; 42 0.2,3; 43 -0.2,3; 44 -0.6,3; 45 -1,3; 46 -1.4,3; 47 -1.8,3; 48 -2.2,3 | smd 4.7 x 4.7: PAD 0,0 | drill 0.4: PAD@VIA01 -1.8,1.8; PAD@VIA02 -1.8,0.6; PAD@VIA03 -1.8,-0.6; PAD@VIA04 -1.8,-1.8; PAD@VIA05 -0.6,1.8; PAD@VIA06 -0.6,0.6; PAD@VIA07 -0.6,-0.6; PAD@VIA08 -0.6,-1.8; PAD@VIA09 0.6,1.8; PAD@VIA10 0.6,0.6; PAD@VIA11 0.6,-0.6; PAD@VIA12 0.6,-1.8; PAD@VIA13 1.8,1.8; PAD@VIA14 1.8,0.6; PAD@VIA15 1.8,-0.6; PAD@VIA16 1.8,-1.8
QFN20_4MM = smd 0.73 x 0.28: P$1 -1.965,1; P$2 -1.965,0.5; P$3 -1.965,0; P$4 -1.965,-0.5; P$5 -1.965,-1; P$11 1.965,-1; P$12 1.965,-0.5; P$13 1.965,0; P$14 1.965,0.5; P$15 1.965,1 | smd 0.28 x 0.73: P$6 -1,-1.965; P$7 -0.5,-1.965; P$8 0,-1.965; P$9 0.5,-1.965; P$10 1,-1.965; P$16 1,1.965; P$17 0.5,1.965; P$18 0,1.965; P$19 -0.5,1.965; P$20 -1,1.965 | smd 2.5 x 2.5: P$21 0,0
ANT_PCB_2.4GHZ_NRF8001_1.6MM_1OZ = smd 1.27 x 1.27: FEED 0,0; TESTPOINT -8.169,17.605
BT-XTAL_2016_N = smd 0.95 x 0.85: 1 -0.725,-0.575; 2 0.725,-0.575; 3 0.725,0.575; 4 -0.725,0.575
XTAL_3215_N = smd 1 x 1.8: 1 -1.25,0; 2 1.25,0
FH12-26S-0.5SH = smd 0.3 x 1.3: 1 -6.25,3.25; 2 -5.75,3.25; 3 -5.25,3.25; 4 -4.75,3.25; 5 -4.25,3.25; 6 -3.75,3.25; 7 -3.25,3.25; 8 -2.75,3.25; 9 -2.25,3.25; 10 -1.75,3.25; 11 -1.25,3.25; 12 -0.75,3.25; 13 -0.25,3.25; 14 0.25,3.25; 15 0.75,3.25; 16 1.25,3.25; 17 1.75,3.25; 18 2.25,3.25; 19 2.75,3.25; 20 3.25,3.25; 21 3.75,3.25; 22 4.25,3.25; 23 4.75,3.25; 24 5.25,3.25; 25 5.75,3.25; 26 6.25,3.25

### Placement (x,y rotation side)
B1  5.33,29.72 0 top
C1  44.96,29.97 270 top
C2  17.27,22.1 90 top
C3  32.26,3.3 270 top
C4  39.37,22.1 0 top
C5  44.96,24.38 90 top
C6  34.54,22.1 180 top
C7  3.81,15.49 180 top
C8  15.49,18.29 0 top
C9  34.54,24.89 180 top
C10  39.37,25.15 0 top
C11  13.46,9.4 270 top
C12  25.65,9.4 270 top
C13  22.61,9.4 270 top
C14  34.29,13.21 0 top
C15  41.91,29.97 270 top
C16  38.86,29.97 270 top
C17  29.46,3.3 270 top
C18  16.51,9.4 270 top
C19  35.31,9.4 90 top
C20  19.56,9.4 270 top
C21  32.26,9.4 90 top
C22  10.41,9.4 90 top
CHRG/LBO  15.49,25.4 90 top
D3  8.64,12.95 0 top
D4  3.56,12.95 180 top
DONE  15.49,27.69 90 top
FRAME1  0,33.4 0 top
FRAME2  -0.13,33.4 0 top
FRAME3  0.13,33.4 0 top
J2  27.43,30.73 0 top
J5  12.7,30.73 0 top
L1  21.59,29.21 0 top
L2  35.31,3.3 270 top
L3  34.29,16.26 180 top
L4  34.29,19.05 0 top
L5  5.08,4.32 0 top
Q1  5.33,9.65 90 top
R1  19.3,17.78 90 top
R2  20.57,13.72 0 top
R6  13.97,14.48 90 top
R7  16.76,14.48 90 top
R8  10.67,22.61 0 top
R14  11.68,26.42 90 top
R16  3.81,18.29 0 top
R17  3.81,21.08 0 top
THERM  14.48,22.1 270 top
U1  22.35,23.37 270 top
U2  26.67,16.51 270 top
U3  9.65,17.78 180 top
U$28  38.1,2.03 0 bottom
UC_LED  21.84,17.02 180 top
X1  28.96,9.4 0 top
X2  30.23,23.37 90 top
X3  18.8,1.78 0 top

### Tracks (layer width: path | path; a pad name or v marks a point on that pad's centre or on a via)
3.3V  (via drill 0.35)
  Top 0.152: Q1.3 9.06,9.98 9.57,9.47 15.24,9.47 | 15.24,9.47 v18.03,9.47 18.22,9.47 18.29,9.4 18.29,7.37 19.56,7.37 19.55,7.35 X3.15 X3.16 | X3.5 14.67,5.15 14.67,7.04 15.24,7.61 15.24,9.47 | 38.42,30.48 C16.1 | C16.1 C15.1 C1.1 | C10.2 v42.16,25.15 43.25,25.15 C5.1 | v23.67,20.57 23.67,22.4 U1.4 25.59,22.42 25.65,22.35 25.65,27.94 | v23.67,20.57 U2.13 | U2.48 29.86,18.89 v30.73,18.89 | v21.34,20.57 v23.67,20.57 | U2.36 28.87,12.79 28.96,12.7 v29.46,12.7 | 25.65,27.94 24.66,27.94 L1.P$2 | 25.65,27.94 v36.58,27.94 | C16.1 35.24,30.92 J2.4
  Bottom 0.152: 42.16,27.94 v42.16,25.15 | 42.16,27.94 42.16,30.23 41.66,30.73 J2.4 | v23.67,20.57 29.05,20.57 v30.73,18.89 29.46,17.62 v29.46,12.7 | v18.03,9.47 20.48,11.91 20.48,11.94 21.79,13.25 21.79,20.57 v21.34,20.57 | v36.58,27.94 42.16,27.94
ANT  (via drill 0.35)
  Top 0.152: L2.1 C19.1 33.78,9.97 33.78,11.18 33.27,11.68 v29.21,11.68 | v26.62,11.73 26.47,11.88 U2.30
  Bottom 0.152: v29.21,11.68 29.16,11.73 v26.62,11.73
DEC1
  Top 0.152: U2.1 31.7,19.51 32.51,20.32 33.54,20.32 34.62,21.4 34.62,22.94 34.75,23.08 35.52,23.08 35.56,23.11 37.4,23.11 C4.1
DEC3
  Top 0.152: C17.1 27.18,6.54 27.18,11.43 27.69,11.43 27.69,13.49 U2.33
DEC4
  Top 0.152: U2.46 31.69,17.91 L3.2 C14.1
EN
  Top 0.152: U1.3 20.99,22.35 20.07,22.35 19.3,21.59 R1.2
GDR  (via drill 0.35)
  Top 0.152: Q1.4 8.85,10.63 v8.89,10.58 | v21.08,2.03 21.08,4.99 X3.18
  Bottom 0.152: v8.89,10.58 11.94,7.54 11.94,1.27 21.08,1.27 v21.08,2.03
GDR_N
  Top 0.152: Q1.2 8.71,9.33 9.14,8.89 9.14,7.37 9.4,7.11 11.68,7.11 11.94,6.86 11.94,1.27 20.32,1.27 20.32,2.54 20.57,2.79 20.57,5 X3.17
GND  (via drill 0.35)  (1 unrouted)
  Top 0.152: C22.2 C11.1 C18.1 C20.1 C13.1 | C13.1 C12.1 | C13.1 22.61,12.45 19.81,12.45 19.62,12.63 R2.1 18.48,13.72 R7.2 16.76,17.97 C8.2 | U2.45 28.87,17.51 U2.PAD@VIA05 | U2.31 26.94,13.58 26.94,13.91 27.27,14.24 U2.PAD@VIA14 | U3.P$10 8.65,18.78 | U3.P$11 8.65,18.78 | 8.65,18.78 U3.P$21 | C7.2 R16.1 R17.1 2.86,23.27 B1.1 | C16.2 C15.2 C1.2 C5.2 | C16.2 38.42,28.58 C10.1 38.39,25.11 | C16.2 32.58,29.02 32.51,28.96 J2.3 | C9.1 38.17,24.89 38.39,25.11 | C6.1 35.49,21.02 v35.05,20.57 | C4.2 38.39,24.03 38.39,25.11 | X3.3 13.55,6.43 v13.72,6.6 | X3.8 16.05,6.39 v16.26,6.6 | X1.2 29.18,9.32 29.11,9.32 28.46,9.97 X1.4
  Bottom 0.152: v35.05,20.57 35.05,27.94 J2.3 | 24.89,18.31 U2.PAD@VIA04 | 24.89,18.31 U2.PAD@VIA03 | U2.PAD@VIA03 U2.PAD@VIA02 | U2.PAD@VIA02 U2.PAD@VIA01 U2.PAD@VIA05 28.47,17.02 | U2.PAD@VIA09 28.47,17.02 | U2.PAD@VIA09 U2.PAD@VIA13 U2.PAD@VIA14 | U2.PAD@VIA15 U2.PAD@VIA14 | U2.PAD@VIA15 U2.PAD@VIA16 U2.PAD@VIA12 | U2.PAD@VIA12 U2.PAD@VIA08 | U2.PAD@VIA08 24.89,17.13 24.89,18.31 | U2.PAD@VIA08 U2.PAD@VIA07 | U2.PAD@VIA07 U2.PAD@VIA06 | U2.PAD@VIA06 27.11,16 28.47,17.02 | U2.PAD@VIA12 U2.PAD@VIA11 | U2.PAD@VIA11 U2.PAD@VIA10 | U2.PAD@VIA10 U2.PAD@VIA09 | U2.PAD@VIA03 U2.PAD@VIA07 | U2.PAD@VIA02 U2.PAD@VIA06 | U2.PAD@VIA06 U2.PAD@VIA10 | U2.PAD@VIA10 U2.PAD@VIA14 | U2.PAD@VIA07 U2.PAD@VIA11 | U2.PAD@VIA11 U2.PAD@VIA15
  other vias: 29.46,6.1
  pour Bottom: 0.25,33.02 47.75,33.02 47.75,21.08 36.83,21.08 36.83,0 0,0 0,33.02
  pour Top: 0,33.27 48.01,33.27 48.01,21.08 36.83,21.08 36.83,0 0,0
N$1
  Top 0.152: U1.5 22.42,24.32 20.07,26.67 20.07,28.93 L1.P$1
N$2
  Top 0.152: L3.1 L4.2
N$3
  Top 0.152: U2.35 28.47,10.9 28.7,10.67 28.99,10.67 X1.3 30.73,9.97 C21.1
N$4
  Top 0.152: D3.C 7.11,12.95 6.35,13.72 3.3,13.72 3.05,13.46 3.05,10.66 Q1.5 Q1.6 3.99,9.98 4.06,9.91 4.06,8.22 4.42,7.87 4.42,5.46 L5.P$1
N$5
  Top 0.152: L4.1 32.51,19.05 31.75,18.29 29.69,18.29 U2.47
N$6  (via drill 0.35)
  Top 0.152: D4.A 2.41,11.02 2.31,10.92 2.31,9.42 2.29,9.4 3.01,9.4 Q1.7 Q1.8 3.08,8.35 v3.81,7.62 | L5.P$2 5.1,6.1 v5.08,6.1
  Bottom 0.152: v5.08,6.1 3.81,7.37 v3.81,7.62
N$7
  Top 0.152: R7.1 R6.1 12.29,15.21 12.29,16.93 12.19,17.03 12.19,17.27 12.18,17.28 U3.P$2
N$8
  Top 0.152: R14.2 14.12,27.37 DONE.C
N$9
  Top 0.152: U3.P$7 10.15,21.32 10.6,21.76 10.6,24.38 R14.1
N$10
  Top 0.152: U3.P$5 12.18,18.78 12.19,18.8 12.19,20.83 12.51,21.15 THERM.2
N$11
  Top 0.152: U3.P$8 9.65,22.54 R8.1
N$12
  Top 0.152: R8.2 12.95,23.94 12.95,25.4 CHRG/LBO.C
N$13
  Top 0.152: U3.P$12 7.12,18.28 5.33,20.07 5.33,20.51 R17.2
N$15
  Top 0.152: UC_LED.C 21.52,15.65 R2.2
N$16
  Top 0.152: R16.2 6.35,18.29 6.86,17.78 U3.P$13
P0.00/XL1
  Top 0.152: C6.2 33.57,22.12 X2.1 30.23,21.6 28.54,19.91 28.54,19.58 U2.2
P0.01/XL2
  Top 0.152: U2.3 28.14,19.58 28.14,21.76 30.23,23.84 X2.2 33.32,24.62 C9.2
P0.11
  Top 0.152: U2.14 23.65,18.29 22.61,18.29 22.39,18.07 UC_LED.A
P0.22  (via drill 0.35)
  Top 0.152: U2.27 25.27,12.84 24.74,12.32 24.74,12.3 24.74,12.29 24.39,12.29 24.03,11.94 24.03,11.43 24.08,11.38 v24.08,10.96 | v17.53,6.86 17.53,5.05 X3.11
  Bottom 0.152: v24.08,10.96 24.08,7.16 24.13,7.11 17.78,7.11 v17.53,6.86
P0.23  (via drill 0.35)
  Top 0.152: U2.28 25.65,13.49 25.65,12.54 25.4,12.54 25.05,12.19 25.05,12.09 v24.64,11.68 | v18.8,6.21 18.66,6.21 18.54,6.1 X3.13
  Bottom 0.152: v24.64,11.68 25.15,11.43 25.3,11.43 25.3,6.19 25.35,6.15 18.86,6.15 v18.8,6.21
P0.24  (via drill 0.35)
  Top 0.152: U2.29 26.07,12.35 v25.65,11.94 | v19.05,3.3 v19.05,3.31 X3.14
  Bottom 0.152: v25.65,11.94 25.65,3.86 20.33,3.86 19.26,2.79 19.05,3.01 v19.05,3.3
P0.25  (via drill 0.35)
  Top 0.152: U2.37 29.74,14.31 v30.33,13.72 | v17.78,2.79 17.78,3.05 18.03,3.3 18.03,5.02 X3.12
  Bottom 0.152: v30.33,13.72 30.33,13.61 30.63,13.31 30.63,3.94 30.23,3.53 30.2,3.55 20.45,3.55 19.56,2.66 19.56,2.49 18.09,2.49 v17.78,2.79
P0.30  (via drill 0.35)
  Top 0.152: U2.42 29.74,16.24 30.07,16.24 30.31,16 v30.53,16 | v16,2.49 16,3.5 16.97,3.5 17.02,3.56 17.02,5 X3.10
  Bottom 0.152: v30.53,16 30.53,15.96 30.94,15.54 30.94,3.81 30.23,3.1 30.08,3.25 20.58,3.25 19.87,2.54 19.87,2.24 19.81,2.18 16,2.18 v16,2.49
P0.31  (via drill 0.35)
  Top 0.152: U2.43 31.19,16.71 v31.24,16.76 | v14.99,2.18 14.99,3.81 16.51,3.81 16.55,3.85 X3.9
  Bottom 0.152: v31.24,16.76 31.24,3.56 30.48,2.79 21.61,2.79 21.46,2.94 20.7,2.94 20.17,2.41 20.17,1.88 15.29,1.88 v14.99,2.18
RF  (via drill 0.35)
  Top 0.152: L2.2 35.37,2.29 v36.83,2.29
  Bottom 0.152: v36.83,2.29 36.83,2.03 U$28.FEED
SWDCLK  (via drill 0.35)
  Top 0.152: U2.25 23.91,12.95 v23.37,12.95
  Bottom 0.152: v23.37,12.95 22.4,12.95 22.61,13.16 22.61,28.7 22.86,28.96 29.97,28.96 J2.2
SWDIO  (via drill 0.35)
  Top 0.152: U2.26 24.87,12.87 24.59,12.6 24.26,12.6 23.73,12.06 23.73,11.94 v23.37,11.94
  Bottom 0.152: v23.37,11.94 22.1,11.94 22.1,30.23 22.61,30.73 J2.1
TPCOM
  Top 0.152: X3.1 12.55,7.53 C11.2
VBAT  (via drill 0.35)
  Top 0.152: R1.1 19.24,16.76 17.78,16.76 | 17.78,16.76 v17.53,16.76 | v11.68,14.99 10.67,14.99 10.67,15.8 U3.P$20 U3.P$1 | U1.1 18.98,24.32 18.8,24.13 18.8,21.84 18.54,21.59 17.71,21.59 C2.1 17.78,20.64 17.78,16.76
  Bottom 0.152: v17.53,16.76 15.75,14.99 v11.68,14.99
VBUS  (via drill 0.35)
  Top 0.152: R6.2 14.54,16 C8.1 | C8.1 U3.P$4 U3.P$3 11.75,17.65 12.25,17.65 12.32,17.57 v12.75,17.57 | U3.P$18 U3.P$19 | U3.P$17 U3.P$18 | U3.P$18 v9.65,14.73 | U3.P$9 9.15,20.31 9.14,20.32 9.14,20.83 v8.89,21.08 | C8.1 14.48,18.35 14.48,19.81 14.73,20.07 15.75,20.07 15.75,24.38 16.54,25.18 CHRG/LBO.A DONE.A 16.54,29.43 J5.2
  Bottom 0.152: v12.75,17.57 12.24,17.57 v9.65,14.73 9.65,20.32 v8.89,21.08
VDD
  Top 0.152: X3.6 X3.7 15.49,5.08 15.49,7.43 C18.2
VGH  (via drill 0.35)
  Top 0.152: 19.81,8.45 C20.2 | 19.81,8.45 20.25,8.45 21.59,7.11 21.59,5.07 X3.19 X3.20 | v21.08,11.68 12.29,11.68 12.19,11.59 6.08,11.59 D4.C | v21.08,8.64 20,8.64 19.81,8.45
  Bottom 0.152: v21.08,11.68 v21.08,8.64
VGL  (via drill 0.35)
  Top 0.152: C22.1 10.6,8.64 v11.94,8.64 | v11.94,12.19 11.18,12.95 D3.A | v22.35,2.03 22.55,2.23 X3.21 X3.22
  Bottom 0.152: v11.94,12.19 v11.94,8.64 12.24,8.33 12.24,1.57 20.32,1.57 20.48,1.73 20.48,2.28 20.83,2.64 21.33,2.64 21.94,2.03 v22.35,2.03
VLIPO  (via drill 0.35)
  Top 0.152: C7.1 6.4,15.49 U3.P$15 | U3.P$15 U3.P$14 6.87,17.28 v6.6,17.02 | U3.P$15 U3.P$16 | v6.6,22.35 6.6,25.02 B1.2
  Bottom 0.152: v6.6,17.02 v6.6,22.35
VSH
  Top 0.152: X3.24 X3.23 23.62,5.1 23.62,6.6 23.11,7.11 22.86,7.11 22.61,7.37 C13.2
VSL
  Top 0.152: C12.2 25.05,7.84 25.05,5.33 | 25.05,5.33 X3.26 | X3.25 24.85,5.33 25.05,5.33
X1
  Top 0.152: U2.34 28,13.44 28,11.31 27.94,11.25 27.94,10.67 27.9,10.63 27.66,10.63 27.53,10.49 27.53,9.45 27.66,9.32 27.73,9.32 X1.1 32.26,4.8 C3.1

### Text on the board
tPlace: GND | 5V IN | SWDIO | SWDCLK | GND\ | 3.3V | Michael Currie | Bioworld ePaper shoe | Complete board for | V1.0
bPlace: Michael Currie | V1.0